# EAGLE design stepup-uc3845 (EAGLE 8.3.1)
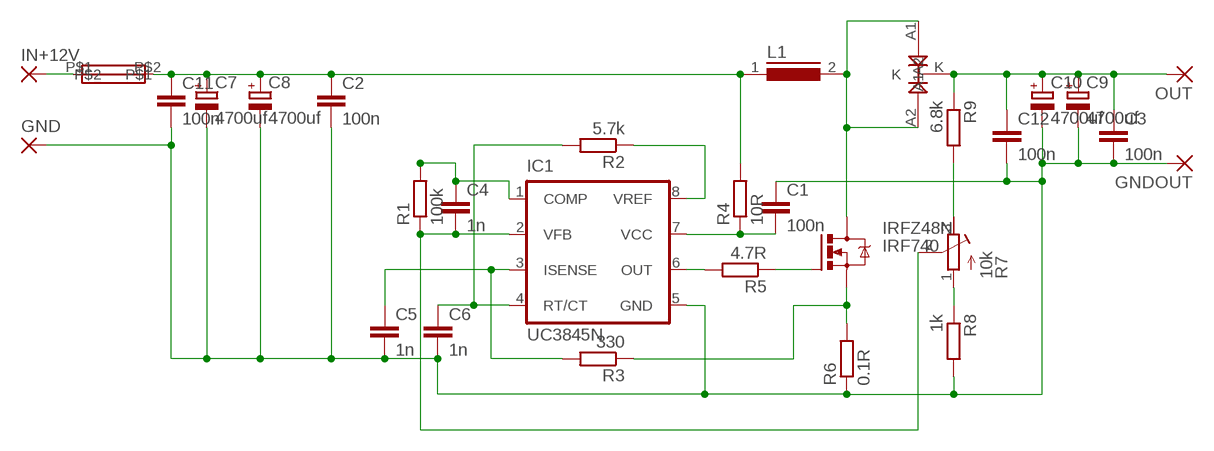
[diagram p0: schematic, sheet 1]

## Parts
C1  100n  C-EU050-025X075  [C050-025X075]
C2  100n  C-EU050-025X075  [C050-025X075]
C3  100n  C-EU050-025X075  [C050-025X075]
C4  1n  C-EU050-025X075  [C050-025X075]
C5  1n  C-EU050-025X075  [C050-025X075]
C6  1n  C-EU050-025X075  [C050-025X075]
C7  4700uf  CPOL-EUE7.5-16  [E7,5-16]
C8  4700uf  CPOL-EUE7.5-16  [E7,5-16]
C9  4700uf  CPOL-EUE7.5-18  [E7,5-18]
C10  4700uf  CPOL-EUE7.5-18  [E7,5-18]
C11  100n  C-EU050-025X075  [C050-025X075]
C12  100n  C-EU050-025X075  [C050-025X075]
F1  10A  FUSE38X12  [FUSE38X12]
GND  3,81/1,1  [3,81/1,1]
GNDOUT  3,81/1,1  [3,81/1,1]
IC1  UC3845N  [DIL08]
IN+12V  3,81/1,1  [3,81/1,1]
IRFZ48N  IRF740  [TO220BV]
L1  R3311D11  [11-33]
OUT  3,81/1,1  [3,81/1,1]
R1  100k  R-EU_0204/7  [0204/7]
R2  5.7k  R-EU_0207/7  [0207/7]
R3  330  R-EU_0207/7  [0207/7]
R4  10R  R-EU_0617/17  [0617/17]
R5  4.7R  R-EU_0207/7  [0207/7]
R6  0.1R  R-EU_0922/22  [0922/22]
R7  10k  R-TRIMM3296W  [RTRIM3296W]
R8  1k  R-EU_0207/7  [0207/7]
R9  6.8k  R-EU_0207/7  [0207/7]
U$1  TO-247-SHOTTKY-K  [TO-247]

## Nets
GND: C1.1 C2.2 C3.2 C5.2 C6.2 C7.- C8.- C9.- C10.- C11.2 C12.2 GND.1(P) GNDOUT.1(P) IC1.5(GND) R6.1 R8.2
N$1: C6.1 IC1.4(RT/CT) R2.2
N$2: C5.1 IC1.3(ISENSE) R3.2
N$3: C4.2 IC1.2(VFB) R1.1 R7.2(S)
N$4: C4.1 IC1.1(COMP) R1.2
N$5: IC1.6(OUT) R5.2
N$6: IRFZ48N.G R5.1
N$7: IC1.8(VREF) R2.1
N$8: C1.2 IC1.7(VCC) R4.1
N$9: IRFZ48N.S R3.1 R6.2
N$10: F1.P$1 IN+12V.1(P)
N$11: C2.1 C7.+ C8.+ C11.1 F1.P$2 L1.1 R4.2
N$12: C3.1 C9.+ C10.+ C12.1 OUT.1(P) R9.1 U$1.K
N$13: R7.1(A) R8.1
N$14: R7.3(E) R9.2
N$15: IRFZ48N.D L1.2 U$1.A1 U$1.A2

## Library data of the parts
C1-C6 C11 C12 = resistor:C-EU: CAPACITOR, European symbol
C7-C10 = resistor:CPOL-EU: POLARIZED CAPACITOR, European symbol
F1 = mgvc:FUSE38X12
GND GNDOUT IN+12V OUT = wirepad:3,81/1,1: THROUGH-HOLE PAD
IC1 = v-reg:UC384*: SMPS Controller Source: http://www.fairchildsemi.com/ds/UC/UC3843.pdf
IRFZ48N = transistor-power:IRF740: N-CHANNEL MOS FET
L1 = inductor-nkl:R3311D: Speicherdrossel (bis typ. 250kHz) storage choke (up to typ. 250kHz); OC_FARNELL: unknown; OC_NEWARK: unknown
R1-R6 R8 R9 = resistor:R-EU_: RESISTOR, European symbol
R7 = resistor:R-TRIMM: Trimm resistor
U$1 = mgvc:TO-247-SHOTTKY-K: Diode shottky TO-247 common kathode

## Board
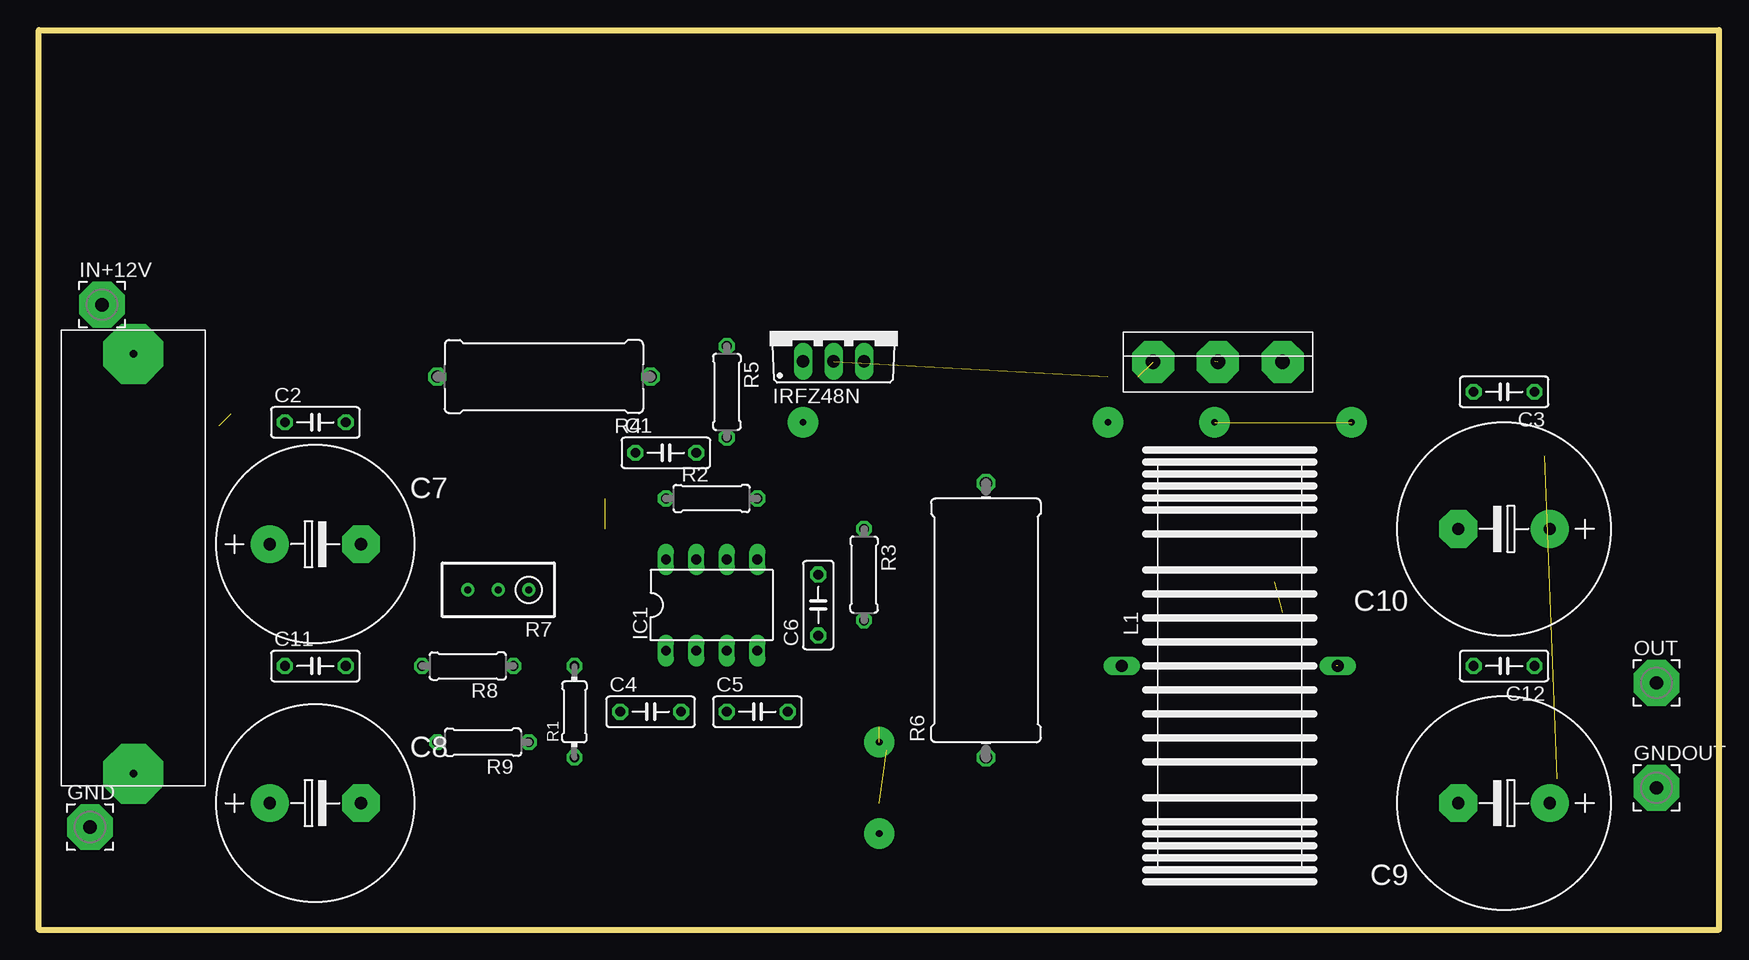
[diagram p1: board, top side]
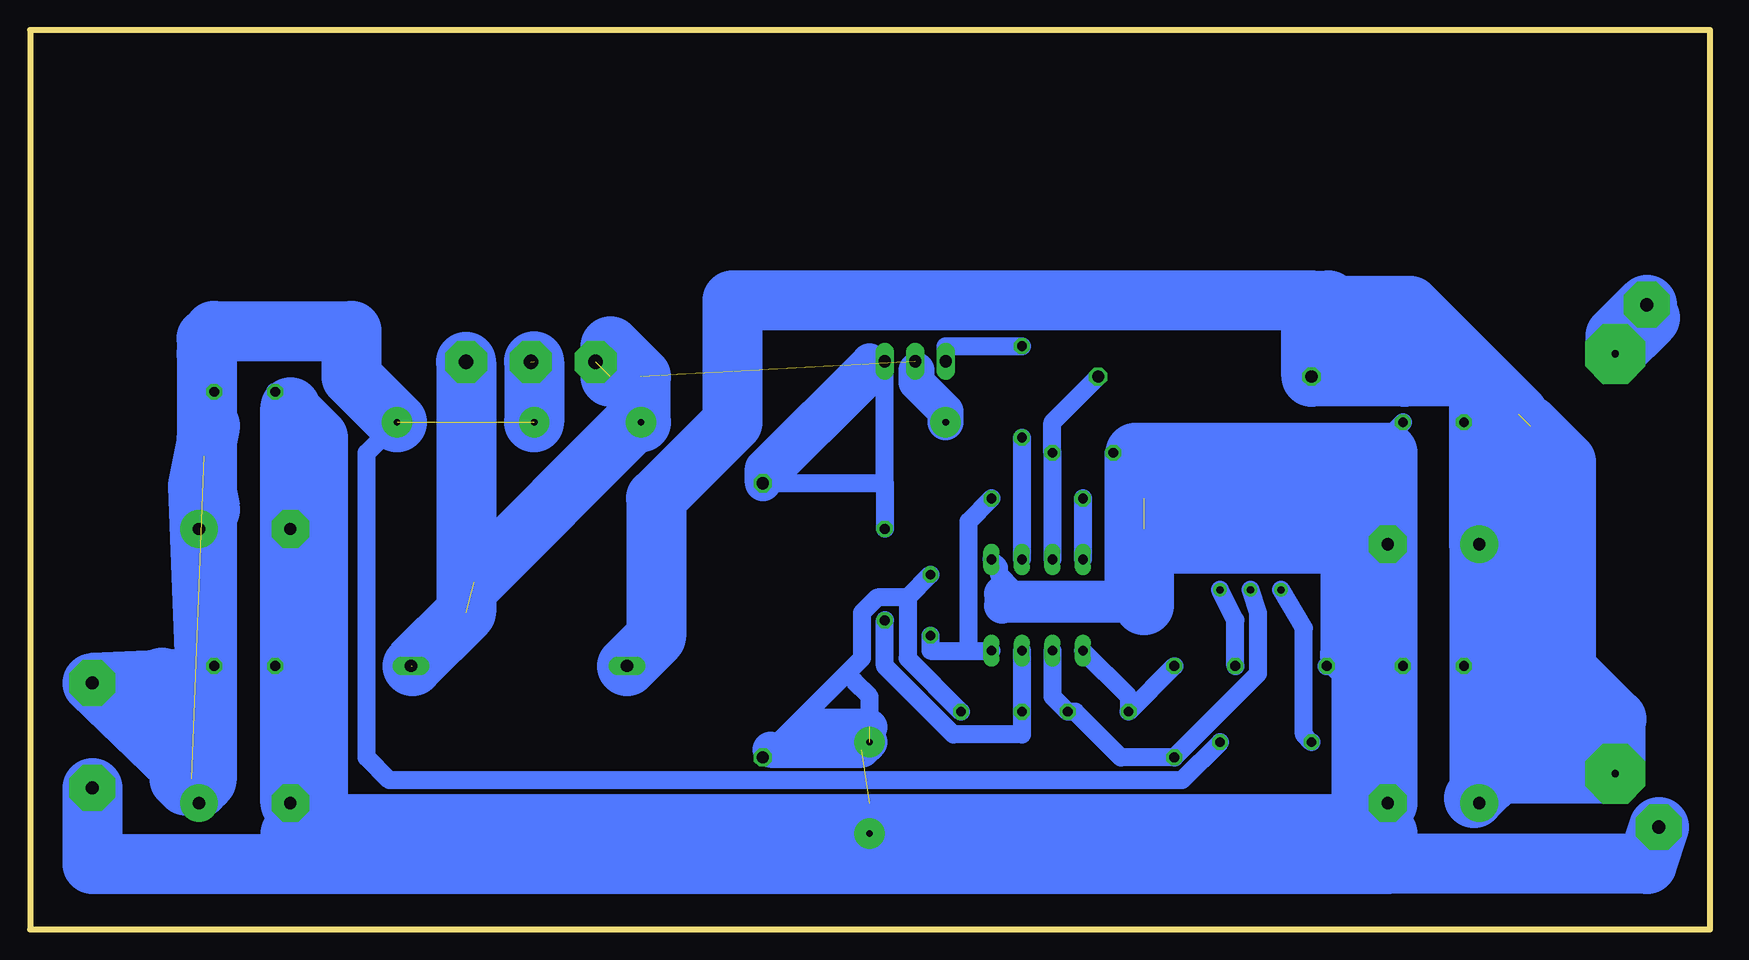
[diagram p2: board, bottom side, seen from below]

Size 140 x 75 mm. Coordinates in mm from the lower left corner, seen from the top.
Outline: 0,0 140,0 140,75 0,75 0,0
Copper layers (1*16): Top 0.035mm / dielectric 1.5mm / Bottom 0.035mm
Design rules "default *": minimum track width 1.5mm, minimum drill 0.35mm, track to track 6mil, track to pad 6mil, pad to pad 6mil, via to via 6mil, smd to smd 6mil, copper to edge 40mil, drill to drill 6mil, minimum pad ring 10mil, minimum via ring 8mil, stop-mask expansion 4mil, vias tented up to drill 0mil, thermal gap 10mil

### Footprints (pad centres in the part's own frame; a part is rotated, then mirrored left to right if it is on the bottom)
C050-025X075 = drill 0.813 octagon: 1 -2.54,0; 2 2.54,0
E7,5-16 = drill 1.016 pad 3.15: + -3.81,0 | drill 1.016 pad 3.15 octagon: - 3.81,0
E7,5-18 = drill 1.016 pad 3.15: + -3.81,0 | drill 1.016 pad 3.15 octagon: - 3.81,0
FUSE38X12 = drill 0.6 pad 5 octagon: P$1 2,6; P$2 37,6
3,81/1,1 = drill 1.118 pad 3.81 octagon: 1 0,0
DIL08 = drill 0.813 long: 1 -3.81,-3.81; 2 -1.27,-3.81; 3 1.27,-3.81; 4 3.81,-3.81; 5 3.81,3.81; 6 1.27,3.81; 7 -1.27,3.81; 8 -3.81,3.81
TO220BV = drill 1.016 long: D 0,-2.54; G -2.54,-2.54; S 2.54,-2.54
11-33 = drill 1.016 long: 1 -9,0; 2 9,0
0204/7 = drill 0.813 octagon: 1 -3.81,0; 2 3.81,0
0207/7 = drill 0.813 octagon: 1 -3.81,0; 2 3.81,0
0617/17 = drill 1.016 octagon: 1 -8.89,0; 2 8.89,0
0922/22 = drill 1.016 octagon: 1 -11.43,0; 2 11.43,0
RTRIM3296W = drill 0.61: 1 0,-2.54; 2 0,0; 3 0,2.54
TO-247 = drill 1.21 pad 3.5 octagon: A1 2.5,2.5; A2 13.3,2.5; K 7.9,2.5

### Placement (x,y rotation side)
C1  52.26,39.75 0 top
C2  23.05,42.29 0 top
C3  122.11,44.83 180 top
C4  50.99,18.16 0 top
C5  59.88,18.16 0 top
C6  64.96,27.05 90 top
C7  23.05,32.13 0 top
C8  23.05,10.54 0 top
C9  122.11,10.54 180 top
C10  122.11,33.4 180 top
C11  23.05,21.97 0 top
C12  122.11,21.97 180 top
F1  1.89,50 270 top
GND  4.27,8.54 0 top
GNDOUT  134.81,11.81 0 top
IC1  56.07,27.05 0 top
IN+12V  5.27,52.1 0 top
IRFZ48N  66.23,49.91 0 top
L1  99.25,21.97 0 top
OUT  134.81,20.56 0 top
R1  44.64,18.16 90 top
R2  56.07,35.94 0 top
R3  68.77,29.59 270 top
R4  42.1,46.1 180 top
R5  57.34,44.83 270 top
R6  78.93,25.78 90 top
R7  38.29,28.32 90 top
R8  35.75,21.97 180 top
R9  37.02,15.62 180 top
U$1  90.36,44.83 0 top

### Tracks (layer width: path | path; a pad name or v marks a point on that pad's centre or on a via)
GND  (via drill 0.55 pad 2.54)  (3 unrouted)
  Bottom 1.5: C3.2 118.3,43.56 C10.- 118.3,23.24 C12.2 119.57,11.81 C9.- | 134.81,6.73 129.73,5.46 118.3,6.73 118.3,8 C9.- | C5.2 66.87,22.61 66.87,27.68 | C6.2 66.87,27.68 | 66.87,27.68 69.41,27.68 70.67,26.41 70.67,22.61 78.3,14.98 R6.1 | R8.2 29.06,21.97 26.86,21.97 | 26.86,21.97 C11.2 | C2.2 26.86,41.02 26.86,39.75 C7.- 26.86,21.97 | 47.88,39.75 C1.1 49.72,28.32 57.98,28.32 59.24,29.59 59.24,30.23 IC1.5 | 26.86,21.97 C8.- | GND.1 6.54,6.73 26.23,6.73 26.23,10.54 C8.- | C8.- 28.34,10.54 70.04,10.54 | 70.04,10.54 116,10.54 C9.- | v70.04,15.62 70.04,19.43 71.31,20.7 | 70.04,10.54 v70.04,8
  Bottom 3: 70.04,16.89 75.12,16.89 | 78.3,14.98 70.67,14.98 v70.04,15.62 | 47.18,27.05 58.95,27.05 | 58.95,27.05 59,27 | 58.95,27.05 58.95,27.95 59,28
  Bottom 5: GND.1 5.27,5.46 26.86,5.46 | 26.86,5.46 26.86,8 118.3,8 | GNDOUT.1 134.81,6.73 134.81,5.46 129.73,5.46 26.86,5.46 | C9.- 118.3,43.56 | C8.- 26.86,39.75 47.88,39.75 | 26.86,35.94 47.18,35.94 | 45.91,32.13 47.18,33.4 | 45.91,32.13 47.18,32.13 47.18,27.05 | C7.- 30,32.13 | 30,32.13 45.91,32.13 | 30,32.13 30,22.91 29.06,21.97 29.06,11.26 28.34,10.54 | 116,10.54 116,41 118,43
N$1
  Bottom 1.5: 61.78,23.24 64.96,23.24 C6.1 | 61.78,23.24 IC1.4 | R2.2 61.78,34.03 61.78,23.24
N$2
  Bottom 1.5: IC1.3 C5.1 57.34,16.26 63.05,16.26 68.77,21.97 R3.2
N$3
  Bottom 1.5: IC1.2 54.8,19.43 C4.2 52.9,18.16 49.09,14.35 R1.1 37.66,21.34 37.66,26.41 R7.2
N$4
  Bottom 1.5: R1.2 C4.1 48.45,19.43 IC1.1
N$5
  Bottom 1.5: R5.2 IC1.6
N$6
  Bottom 1.5: R5.1 63.69,48.64 IRFZ48N.G
N$7
  Bottom 1.5: R2.1 IC1.8
N$8
  Bottom 1.5: IC1.7 C1.2 54.8,42.29 R4.1
N$9
  Bottom 1.5: 68.77,37.21 IRFZ48N.S | 68.77,37.21 R3.1 | R6.2 68.77,37.21
  Bottom 3: R6.2 78.93,38.48 70.04,47.37 70.04,46.1 R6.2
N$10
  Bottom 5: IN+12V.1 7.89,49.48 F1.P$1 7.89,48.11 5,51
N$11  (1 unrouted)
  Bottom 1.5: 19.24,28.32 C7.+ 19.24,41.02 C2.1 20.51,46.1 25.44,46.1 R4.2 | 19.24,28.32 19.24,23.24 C11.1 20.51,11.81 19.67,10.97 C8.+ | 18.61,28.32 19.24,28.32
  Bottom 5: 18.61,28.32 7.81,17.52 7.89,17.45 F1.P$2 16,13 | 25.44,46.1 19.24,46.1 C7.+ 19.24,11.81 | 25.44,46.1 R4.2 33.21,52.45 | 33.21,52.45 81.47,52.45 81.47,42.29 87.82,35.94 87.82,24.4 L1.1 | 16,13 17.64,13 19.67,10.97 | 16,13 16,43 | 16,43 19,46 | 12,13 12,39 15,42 | 33.21,52.45 31.79,52.45 25.44,46.1 | 16,43 25,52 31,52
N$12  (via drill 0.55 pad 2.54)  (3 unrouted)
  Bottom 1.5: 125.92,43.56 C3.1 125.28,44.83 125.28,48 | 125.92,43.56 C10.+ 125.92,23.24 C12.1 125.92,11.81 C9.+ | 125.92,43.56 126.53,12.56 | R9.1 44.01,12.45 110.05,12.45 111.95,14.35 111.95,39.75 v109.41,42.29 | 97.98,46.73 U$1.K
  Bottom 5: 97.98,47.37 v97.98,42.29 | 125.28,48 125.28,49.27 124.65,49.91 113.22,49.91 113.22,46.1 v109.41,42.29 | 125.28,48 125.28,12.45 125.92,11.81 | OUT.1 126.53,12.56 127.53,12.53 127,12 | 125.28,48 125.37,21 | 125.37,21 OUT.1 | 125.37,21 126,37 125,42 | 125.5,39.5 125.5,37.5 125,35 | OUT.1 129.44,20.56 | 129.44,20.56 129,21 | 129.44,20.56 126.44,14.44 126,12
N$13
  Bottom 1.5: R7.1 39.56,25.78 R8.1
N$14
  Bottom 1.5: R7.3 33.84,25.14 33.84,16.26 R9.2
N$15  (via drill 0.55 pad 2.54)  (4 unrouted)
  Bottom 1.5: IRFZ48N.D 64.96,43.56 v63.69,42.29
  Bottom 3: 66.1,46.63 66.1,45.61 63.69,43.19 v63.69,42.29
  Bottom 5: U$1.A2 103.66,26.45 108.14,21.97 | 91.63,46.1 91.63,48.64 89.09,46.1 v89.09,42.29 89.71,42.29 103,29